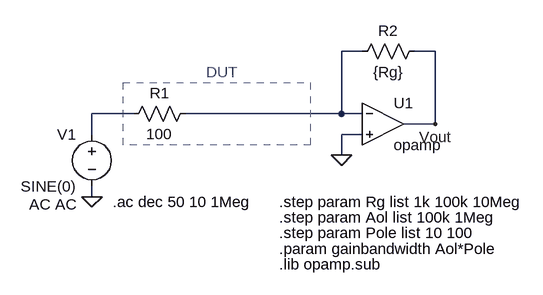
[diagram p0: schematic Draft1.asc]
Draft1.asc, the LTspice schematic file:
Version 4
SHEET 1 880 680
WIRE 192 32 160 32
WIRE 304 32 272 32
WIRE -160 128 -224 128
WIRE 160 128 160 32
WIRE 160 128 -80 128
WIRE 192 128 160 128
WIRE 304 144 304 32
WIRE 304 144 256 144
WIRE -224 160 -224 128
WIRE 192 160 160 160
WIRE 160 192 160 160
WIRE -224 256 -224 240
FLAG 160 192 0
FLAG -224 256 0
FLAG 304 144 Vout
SYMBOL OpAmps\\opamp 224 80 R0
SYMATTR InstName U1
SYMATTR SpiceLine2 GBW={gainbandwidth}
SYMATTR SpiceLine Aol={Aol}
SYMBOL voltage -224 144 M0
WINDOW 123 24 124 Left 2
WINDOW 39 0 0 Left 0
SYMATTR Value2 AC AC
SYMATTR InstName V1
SYMATTR Value SINE(0)
SYMBOL res 288 16 R90
WINDOW 0 0 56 VBottom 2
WINDOW 3 32 56 VTop 2
SYMATTR InstName R2
SYMATTR Value {Rg}
SYMBOL res -64 112 R90
WINDOW 0 0 56 VBottom 2
WINDOW 3 32 56 VTop 2
SYMATTR InstName R1
SYMATTR Value 100
TEXT -48 64 Left 2 ;DUT
TEXT -192 264 Left 2 !.ac dec 50 10 1Meg
TEXT 64 264 Left 2 !.step param Rg list 1k 100k 10Meg
TEXT 64 360 Left 2 !.lib opamp.sub
TEXT 64 336 Left 2 !.param gainbandwidth Aol*Pole
TEXT 64 312 Left 2 !.step param Pole list 10 100
TEXT 64 288 Left 2 !.step param Aol list 100k 1Meg
RECTANGLE Normal 112 176 -176 80 2

The netlist it stands for:
* Draft1.asc
XU1 N001 0 Vout opamp Aol={Aol} GBW={gainbandwidth}  ; pins invin noninvin out
V1 N002 0 SINE(0) AC AC
R2 Vout N001 {Rg}
R1 N001 N002 100
* DUT
.ac dec 50 10 1Meg
.step param Rg list 1k 100k 10Meg
.lib opamp.sub
.param gainbandwidth Aol*Pole
.step param Pole list 10 100
.step param Aol list 100k 1Meg
.backanno
.end